# Altium project phoenix-c1.PrjPcb (part 2 of 3)

## Sheet power_input.SchDoc
size A4; SheetNumber: 3; SheetTotal: 11
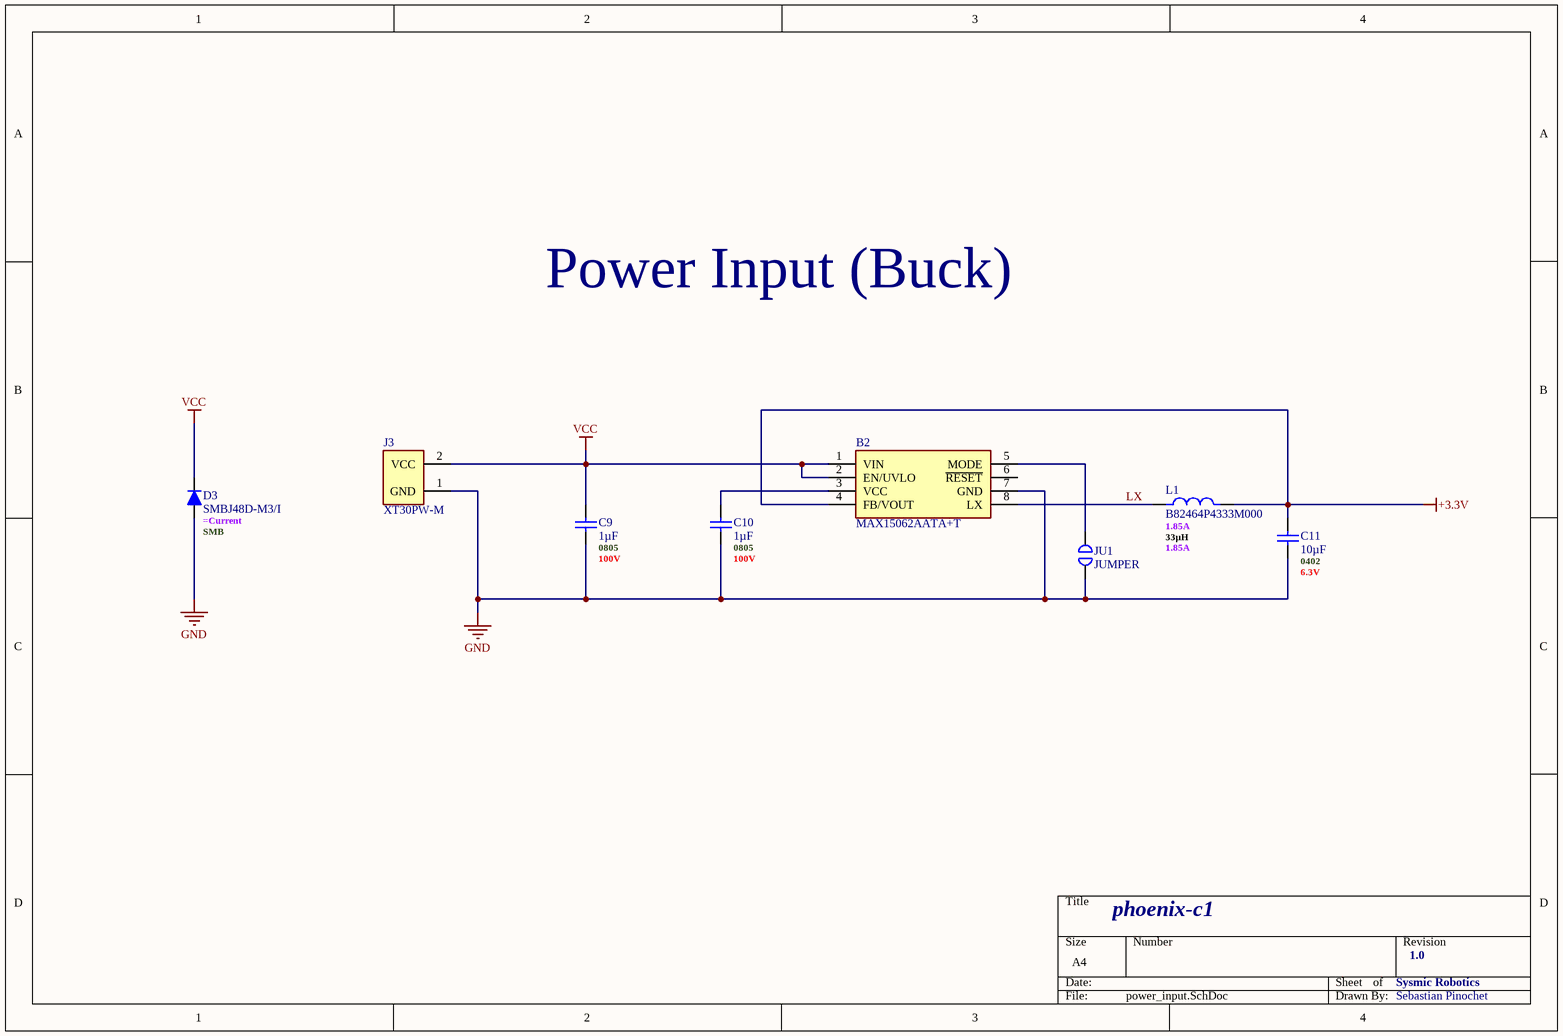
[diagram p6: power_input.SchDoc]

### Parts
B2  MAX15062AATA+T  [8-TDFN - ANALOG]
C9  1µF  .Case/Package: 0805  .Voltage Rating (DC): 100V  [C0805 - MURATA]
C10  1µF  .Case/Package: 0805  .Voltage Rating (DC): 100V  [C0805 - MURATA]
C11  10µF  .Case/Package: 0402  .Voltage Rating (DC): 6.3V  [C0402 - MURATA]
D3  SMBJ48D-M3/I  .Case/Package: SMB  [DDO-214AA (SMBJ) - VISHAY]
J3  XT30PW-M  [CONN - XT30PW-M]
JU1  JUMPER  [JUMPER]
L1  B82464P4333M000  .RMS Current (Irms): 1.85A  .Value: 33µH  [SRN4018-330M]

### Nets
+3.3V: B2.4(FB/VOUT) C11.2 L1.2
GND: B2.7(GND) C9.1 C10.1 C11.1 D3.2 J3.1(GND) JU1.1
VCC: B2.1(VIN) B2.2(EN/UVLO) C9.2 D3.1 J3.2(VCC)
LX: B2.8(LX) L1.1
NetB2_3: B2.3(VCC) C10.2
NetB2_5: B2.5(MODE) JU1.2

Not connected (* = marked no-connect by the designer): B2 6(~{RESET})

### Notes on the sheet
- Power Input (Buck)
- phoenix-c1
- Sysmic Robotics
- 1.0
- Sebastian Pinochet

### Library data of the parts
B2 = MAX15062AATA+T: Step-Down 60V, 300mA, Ultra-Small, High-Efficiency, Synchronous  DC-DC Converters; Manufacturer_Name: Analog Devices; Geometry.Height: 0.8mm; Mouser Part Number: 700-MAX15062AATA+T; Mouser Price/Stock: https://www.mouser.co.uk/ProductDetail/Analog-Devices-Maxim-Integrated/MAX15062AATA%2bT?qs=ffX8NcjNb2RbIuhbYBH8PA%3D%3D; Manufacturer_Part_Number: MAX15062AATA+T; Datasheet Link: https://www.analog.com/MAX15062/datasheet; Supplier 1: Mouser; Supplier Part Number 1: 700-MAX15062AATA+T
C9 C10 = GCM21BC72A105KE36L: Ceramic Capacitor, Ceramic, 100V, 10% +Tol, 10% -Tol, X7S, 22% TC, 1uF, Surface Mount, 0805; Manufacturer: Murata; Manufacturer Lifecycle Status: IN PRODUCTION; Supplier: Mouser; Supplier Part Number: 81-GCM21BC72A105KE6L; Manufacturer Part Number: GCM21BC72A105KE36L; RoHS: Compliant; Category: Ceramic Capacitors; Stock: 5295; Pricing: 1=0,42, 10=0,188, 50=0,188, 100=0,164, 1000=0,123, 10000=0,085 (USD); Value: 1µF; Case/Package: 0805; Dielectric Material: Ceramic; Height: 1.25mm; Length: 2mm; Lifecycle Status: Production; Material: Ceramic; Max Operating Temperature: 125°C; Min Operating Temperature: -55°C; Mounting Technology: Surface Mount; Number of Terminals: 2; REACH SVHC: Yes; Schedule B: 8532240020, 8532240020|8532240020, 8532240020|8532240020|8532240020, 8532240020|8532240020|8532240020|8532240020; Thickness: 1.25mm; Voltage Rating: 100V; Voltage Rating (DC): 100V; Width: 1.25mm; ComponentLink1URL: https://datasheet.octopart.com:443/GCM21BC72A105KE36L-Murata-datasheet-141268580.pdf?src-supplier=Ciiva; ComponentLink1Description: https://datasheet.octopart.com:443/GCM21BC72A105KE36L-Murata-datasheet-141268580.pdf?src-supplier=Ciiva; ComponentLink2URL: https://datasheet.octopart.com:443/GCM21BC72A105KE36L-Murata-datasheet-140660122.pdf?src-supplier=Ciiva; ComponentLink2Description: https://datasheet.octopart.com:443/GCM21BC72A105KE36L-Murata-datasheet-140660122.pdf?src-supplier=Ciiva; ComponentLink3URL: https://datasheet.octopart.com:443/GCM21BC72A105KE36L-Murata-datasheet-138719526.pdf?src-supplier=Ciiva; ComponentLink3Description: https://datasheet.octopart.com:443/GCM21BC72A105KE36L-Murata-datasheet-138719526.pdf?src-supplier=Ciiva; ComponentLink4URL: https://datasheet.octopart.com:443/GCM21BC72A105KE36L-Murata-datasheet-12511495.pdf?src-supplier=TME; ComponentLink4Description: https://datasheet.octopart.com:443/GCM21BC72A105KE36L-Murata-datasheet-12511495.pdf?src-supplier=TME; ComponentLink5URL: http://sigma.octopart.com:80/reach_statement/Murata-company-16.pdf?src-supplier=Compliance+Statements; ComponentLink5Description: http://sigma.octopart.com:80/reach_statement/Murata-company-16.pdf?src-supplier=Compliance+Statements; Supplier 1: Mouser; Supplier Part Number 1: 81-GCM21BC72A105KE6L
C11 = GRM155R60J106ME05D: Ceramic Capacitor, Ceramic, 6.3V, 20% +Tol, 20% -Tol, X5R, 15% TC, 10uF, Surface Mount, 0402; Manufacturer: Murata; Manufacturer Lifecycle Status: IN PRODUCTION; Supplier: Mouser; Supplier Part Number: 81-GRM155R60J106M05D; Manufacturer Part Number: GRM155R60J106ME05D; RoHS: Compliant; Category: Ceramic Capacitors; Stock: 374888; Pricing: 1=0,1, 10=0,021, 50=0,021, 100=0,019, 1000=0,018, 10000=0,014 (USD); Value: 10µF; Case/Package: 0402; Dielectric: X5R; Dielectric Material: Ceramic; Height: 500µm; Length: 1mm; Lifecycle Status: Production; Material: Ceramic; Max Operating Temperature: 85°C; Min Operating Temperature: -55°C; Mounting Technology: Surface Mount; Number of Terminals: 2; REACH SVHC: Yes; Schedule B: 8532240020|8532240020|8532240020|8532240020|8532240020|8532240020|8532240020|8532240020|8532240020|8532240020|8532240020|8532240020|8532240020|8532240020|8532240020|8532240020|8532240020|8532240020|8532240020|8532240020|8532240020|8532240020|8532240020|85; Thickness: 500µm; Tolerance: 20%; Voltage Rating: 6.3V; Voltage Rating (DC): 6.3V; Width: 500µm; ComponentLink1URL: https://datasheet.octopart.com:443/GRM155R60J106ME05D-Murata-datasheet-155239051.pdf?src-supplier=Newark; ComponentLink1Description: https://datasheet.octopart.com:443/GRM155R60J106ME05D-Murata-datasheet-155239051.pdf?src-supplier=Newark; ComponentLink2URL: https://datasheet.octopart.com:443/GRM155R60J106ME05D-Murata-datasheet-165579666.pdf?src-supplier=TME; ComponentLink2Description: https://datasheet.octopart.com:443/GRM155R60J106ME05D-Murata-datasheet-165579666.pdf?src-supplier=TME; ComponentLink3URL: https://datasheet.octopart.com:443/GRM155R60J106ME05D-Murata-datasheet-141266224.pdf?src-supplier=Ciiva; ComponentLink3Description: https://datasheet.octopart.com:443/GRM155R60J106ME05D-Murata-datasheet-141266224.pdf?src-supplier=Ciiva; ComponentLink4URL: https://datasheet.octopart.com:443/GRM155R60J106ME05D-Murata-datasheet-140689296.pdf?src-supplier=Ciiva; ComponentLink4Description: https://datasheet.octopart.com:443/GRM155R60J106ME05D-Murata-datasheet-140689296.pdf?src-supplier=Ciiva; ComponentLink5URL: https://datasheet.octopart.com:443/GRM155R60J106ME05D-Murata-datasheet-138740637.pdf?src-supplier=Ciiva; ComponentLink5Description: https://datasheet.octopart.com:443/GRM155R60J106ME05D-Murata-datasheet-138740637.pdf?src-supplier=Ciiva; ComponentLink6URL: https://datasheet.octopart.com/GRM155R60J106ME05D-Murata-datasheet-12515295.pdf; ComponentLink6Description: https://datasheet.octopart.com/GRM155R60J106ME05D-Murata-datasheet-12515295.pdf; ComponentLink7URL: https://datasheet.octopart.com/GRM155R60J106ME05D-Murata-datasheet-12510076.pdf; ComponentLink7Description: https://datasheet.octopart.com/GRM155R60J106ME05D-Murata-datasheet-12510076.pdf; ComponentLink8URL: https://datasheet.octopart.com/GRM155R60J106ME05D-Murata-datasheet-11978611.pdf; ComponentLink8Description: https://datasheet.octopart.com/GRM155R60J106ME05D-Murata-datasheet-11978611.pdf; ComponentLink9URL: https://datasheet.octopart.com/GRM155R60J106ME05D-Murata-datasheet-10025737.pdf; ComponentLink9Description: https://datasheet.octopart.com/GRM155R60J106ME05D-Murata-datasheet-10025737.pdf; ComponentLink10URL: https://datasheet.octopart.com/GRM155R60J106ME05D-Murata-datasheet-8819587.pdf; ComponentLink10Description: https://datasheet.octopart.com/GRM155R60J106ME05D-Murata-datasheet-8819587.pdf; ComponentLink11URL: http://sigma.octopart.com:80/reach_statement/Murata-company-16.pdf?src-supplier=Compliance+Statements; ComponentLink11Description: http://sigma.octopart.com:80/reach_statement/Murata-company-16.pdf?src-supplier=Compliance+Statements; Supplier 1: Mouser; Supplier Part Number 1: 81-GRM155R60J106M05D
D3 = SMBJ48D-M3/I: Trans Voltage Suppressor Diode, 600W, 48V V(RWM), Unidirectional, 1 Element, Silicon, DO-214AA; Manufacturer: Vishay; Breakdown Voltage: 56.1V; Clamping Voltage: 76.3V; Max Breakdown Voltage: 58.1V; Max Power Dissipation: 1W; Min Breakdown Voltage: 54.1V; Number of Elements: 1; Peak Pulse Current: 7.9A; Power Line Protection: No; Supplier: Mouser; Supplier Part Number: 78-SMBJ48D-M3I; Manufacturer Part Number: SMBJ48D-M3/I; RoHS: Compliant; Category: TVS Diodes; Stock: 7114; Pricing: 1=0,34, 10=0,24, 50=0,24, 100=0,091, 1000=0,091, 10000=0,073 (USD); Case/Package: SMB; China RoHS: Non-Compliant; Composition: Zener; Lifecycle Status: Production; Max Operating Temperature: 150°C; Min Operating Temperature: -55°C; Mounting Technology: Surface Mount; Number of Terminals: 2; Number of Unidirectional Channels: 1; Packaging: Tape & Reel (TR); Peak Pulse Power: 600W; Polarity: Unidirectional; REACH SVHC: No; Reverse Standoff Voltage: 48V; ComponentLink1URL: https://datasheet.octopart.com:443/SMBJ48D-M3-I-Vishay-datasheet-168801400.pdf?src-supplier=IHS; ComponentLink1Description: https://datasheet.octopart.com:443/SMBJ48D-M3-I-Vishay-datasheet-168801400.pdf?src-supplier=IHS; ComponentLink2URL: https://datasheet.octopart.com:443/SMBJ48D-M3-I-Vishay-datasheet-141892618.pdf?src-supplier=Future+Electronics; ComponentLink2Description: https://datasheet.octopart.com:443/SMBJ48D-M3-I-Vishay-datasheet-141892618.pdf?src-supplier=Future+Electronics; ComponentLink3URL: http://sigma.octopart.com:80/rohs_statement/Vishay-company-15.pdf?src-supplier=Compliance+Statements; ComponentLink3Description: http://sigma.octopart.com:80/rohs_statement/Vishay-company-15.pdf?src-supplier=Compliance+Statements; Supplier 1: Mouser; Supplier Part Number 1: 78-SMBJ48D-M3I; .Current: =Current
J3 = XT30PW-M: 30A Low Temperature Rise Fire Retardant Plug; Manufacturer_Name: Amass; Geometry.Height: 5mm; Mouser Part Number: *; Mouser Price/Stock: *; Arrow Part Number: *; Arrow Price/Stock: *; Datasheet Link: https://www.tme.eu/sl/Document/ce4077e36b79046da520ca73227e15de/XT30PW%20SPEC.pdf; Manufacturer_Part_Number: XT30PW-M
L1 = LPS4018-333MRC: General Purpose Inductor, 33uH, 20%, 1 Element, Ferrite-Core, SMD, 1515; Manufacturer: EPCOS; Manufacturer Lifecycle Status: PRODUCTION; DC Resistance (DCR): 75mΩ; Value: 33µH; Number of Circuits: 1; Saturation Current: 2.1A; Shielding: Yes; Test Frequency: 100kHz; Current Rating: 260mA; Q Factor: 30; Self Resonant Frequency: 60MHz; Max Saturation Current: 450mA; Max Temperature Rise Current: 600mA; Temperature Rise Current: 650mA; Supplier: Mouser; Supplier Part Number: 871-B82464P4333M; Manufacturer Part Number: B82464P4333M000; RoHS: Compliant; Category: Fixed Inductors; Stock: 942; Pricing: 1=1,59, 10=1,31, 50=1,14, 100=1,08, 1000=0,885, 10000=0,775 (USD); Case/Package: SMD/SMT; Contact Plating: Tin; Core Material: Ferrite; DC Current: 1.85A; Depth: 10.4mm; Height: 4.8mm; Inductance Tolerance: 20%; Length: 10.4mm; Lifecycle Status: Production; Max Current Rating: 1.85A; Max DC Current: 1.85A; Max Length: 10.4mm; Max Operating Temperature: 150°C; Max Width: 10.4mm; Military Standard: Not; Min Operating Temperature: -55°C; Mounting Technology: Surface Mount; Number of Terminals: 2; REACH SVHC: Yes; RMS Current (Irms): 1.85A; Tolerance: 20%; Width: 10.4mm; ComponentLink1URL: https://datasheet.octopart.com:443/B82464P4333M000-EPCOS-datasheet-155394167.pdf?src-supplier=IHS; ComponentLink1Description: https://datasheet.octopart.com:443/B82464P4333M000-EPCOS-datasheet-155394167.pdf?src-supplier=IHS; ComponentLink2URL: https://datasheet.octopart.com:443/B82464P4333M000-EPCOS-datasheet-13705212.pdf?src-supplier=EPCOS; ComponentLink2Description: https://datasheet.octopart.com:443/B82464P4333M000-EPCOS-datasheet-13705212.pdf?src-supplier=EPCOS; ComponentLink3URL: https://datasheet.octopart.com:443/B82464P4333M000-EPCOS-datasheet-66576979.pdf?src-supplier=Newark; ComponentLink3Description: https://datasheet.octopart.com:443/B82464P4333M000-EPCOS-datasheet-66576979.pdf?src-supplier=Newark; ComponentLink4URL: https://datasheet.octopart.com:443/B82464P4333M000-EPCOS-datasheet-34142370.pdf?src-supplier=Newark; ComponentLink4Description: https://datasheet.octopart.com:443/B82464P4333M000-EPCOS-datasheet-34142370.pdf?src-supplier=Newark; ComponentLink5URL: https://datasheet.octopart.com:443/B82464P4333M000-EPCOS-datasheet-11522271.pdf?src-supplier=element14+APAC; ComponentLink5Description: https://datasheet.octopart.com:443/B82464P4333M000-EPCOS-datasheet-11522271.pdf?src-supplier=element14+APAC; Case Code (Imperial): 1210; Case Code (Metric): 3225; Composition: Wirewound; Height - Seated (Max): 2.3876mm; Lead Free: Lead Free; Min Length: 3mm; Min Width: 2.3mm; Schedule B: 8504500000, 8504500000|8504500000|8504500000|8504500000|8504500000; Termination: SMD/SMT; Weight: 50.008559mg; ComponentLink6URL: https://datasheet.octopart.com:443/NLV32T-3R3J-EF-TDK-datasheet-181268619.pdf?src-supplier=IHS; ComponentLink6Description: https://datasheet.octopart.com:443/NLV32T-3R3J-EF-TDK-datasheet-181268619.pdf?src-supplier=IHS; ComponentLink7URL: https://datasheet.octopart.com:443/NLV32T-3R3J-EF-TDK-datasheet-155380433.pdf?src-supplier=TDK; ComponentLink7Description: https://datasheet.octopart.com:443/NLV32T-3R3J-EF-TDK-datasheet-155380433.pdf?src-supplier=TDK; ComponentLink8URL: https://datasheet.octopart.com:443/NLV32T-3R3J-EF-TDK-datasheet-97126320.pdf?src-supplier=Newark; ComponentLink8Description: https://datasheet.octopart.com:443/NLV32T-3R3J-EF-TDK-datasheet-97126320.pdf?src-supplier=Newark; ComponentLink9URL: https://datasheet.octopart.com:443/NLV32T-3R3J-EF-TDK-datasheet-81471259.pdf?src-supplier=Newark; ComponentLink9Description: https://datasheet.octopart.com:443/NLV32T-3R3J-EF-TDK-datasheet-81471259.pdf?src-supplier=Newark; ComponentLink10URL: https://datasheet.octopart.com:443/NLV32T-3R3J-EF-TDK-datasheet-136874827.pdf?src-supplier=TME; ComponentLink10Description: https://datasheet.octopart.com:443/NLV32T-3R3J-EF-TDK-datasheet-136874827.pdf?src-supplier=TME; ComponentLink11URL: https://datasheet.octopart.com:443/NLV32T-3R3J-EF-TDK-datasheet-61115007.pdf?src-supplier=Future+Electronics; ComponentLink11Description: https://datasheet.octopart.com:443/NLV32T-3R3J-EF-TDK-datasheet-61115007.pdf?src-supplier=Future+Electronics; Packaging: Tape & Reel (TR); ComponentLink12URL: https://datasheet.octopart.com:443/MBKK1608T3R3M-Taiyo-Yuden-datasheet-181265470.pdf?src-supplier=IHS; ComponentLink12Description: https://datasheet.octopart.com:443/MBKK1608T3R3M-Taiyo-Yuden-datasheet-181265470.pdf?src-supplier=IHS; ComponentLink13URL: https://datasheet.octopart.com:443/MBKK1608T3R3M-Taiyo-Yuden-datasheet-154809596.pdf?src-supplier=Master+Electronics; ComponentLink13Description: https://datasheet.octopart.com:443/MBKK1608T3R3M-Taiyo-Yuden-datasheet-154809596.pdf?src-supplier=Master+Electronics; ComponentLink14URL: https://datasheet.octopart.com:443/MBKK1608T3R3M-Taiyo-Yuden-datasheet-168245478.pdf?src-supplier=Future+Electronics; ComponentLink14Description: https://datasheet.octopart.com:443/MBKK1608T3R3M-Taiyo-Yuden-datasheet-168245478.pdf?src-supplier=Future+Electronics; ComponentLink15URL: https://datasheet.octopart.com:443/MBKK1608T3R3M-Taiyo-Yuden-datasheet-140707427.pdf?src-supplier=Taiyo+Yuden+SCT; ComponentLink15Description: https://datasheet.octopart.com:443/MBKK1608T3R3M-Taiyo-Yuden-datasheet-140707427.pdf?src-supplier=Taiyo+Yuden+SCT; ComponentLink16URL: https://datasheet.octopart.com:443/LPS4018-333MRC-Coilcraft-datasheet-178522552.pdf?src-supplier=IHS; ComponentLink16Description: https://datasheet.octopart.com:443/LPS4018-333MRC-Coilcraft-datasheet-178522552.pdf?src-supplier=IHS; ComponentLink17URL: https://datasheet.octopart.com:443/LPS4018-333MRC-Coilcraft-datasheet-10791166.pdf?src-supplier=Coilcraft+Direct; ComponentLink17Description: https://datasheet.octopart.com:443/LPS4018-333MRC-Coilcraft-datasheet-10791166.pdf?src-supplier=Coilcraft+Direct; Supplier 1: Mouser; Supplier Part Number 1: 994-LPS4018-333MRC; .Max DC Current: 1.85A

## Sheet stm32g4.SchDoc
size A4; SheetNumber: 2; SheetTotal: 11
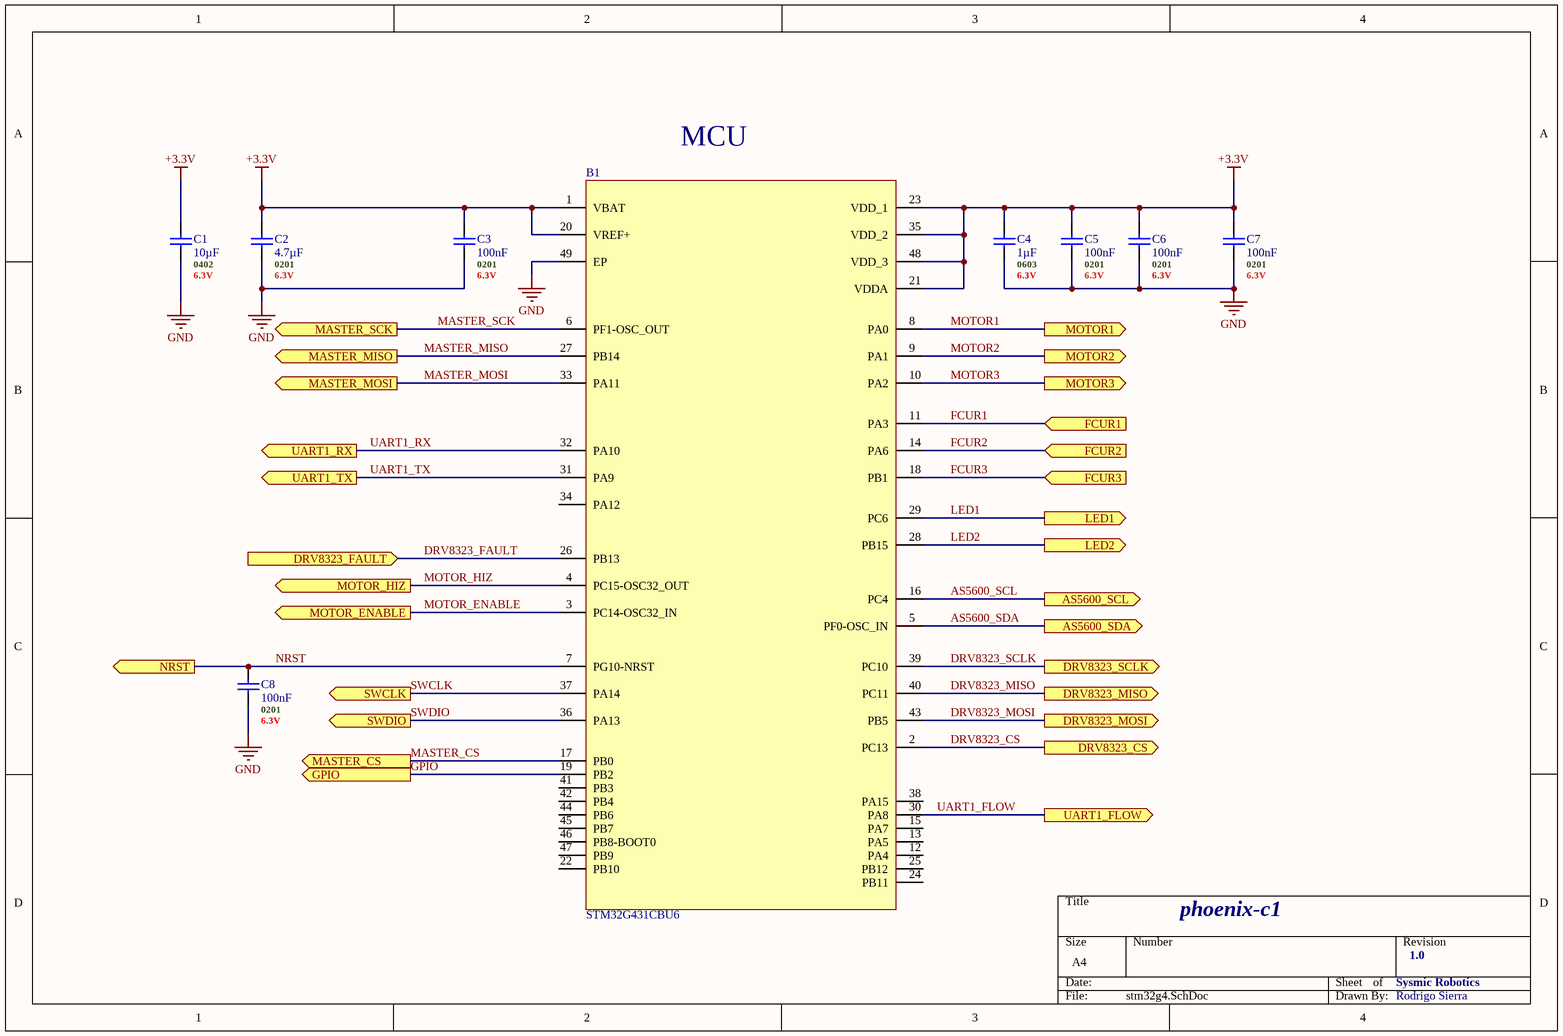
[diagram p7: stm32g4.SchDoc]

### Parts
B1  STM32G431CBU6  [48-UFQFN - STMicroelectronics]
C1  10µF  .Case/Package: 0402  .Voltage Rating (DC): 6.3V  [C0402 - MURATA]
C2  4.7µF  .Case/Package: 0201  .Voltage Rating (DC): 6.3V  [C0201 - MURATA]
C3  100nF  .Case/Package: 0201  .Voltage Rating (DC): 6.3V  [C0201 - MURATA]
C4  1µF  .Case/Package: 0603  .Voltage Rating (DC): 6.3V  [C0603 - MURATA]
C5  100nF  .Case/Package: 0201  .Voltage Rating (DC): 6.3V  [C0201 - MURATA]
C6  100nF  .Case/Package: 0201  .Voltage Rating (DC): 6.3V  [C0201 - MURATA]
C7  100nF  .Case/Package: 0201  .Voltage Rating (DC): 6.3V  [C0201 - MURATA]
C8  100nF  .Case/Package: 0201  .Voltage Rating (DC): 6.3V  [C0201 - MURATA]

### Ports
AS5600_SCL (out, see phoenix-c1-sch[2C], encoder[3B]), AS5600_SDA (out, see phoenix-c1-sch[2C], encoder[3B]), DRV8323_CS (out, see phoenix-c1-sch[3C], gate_driver[1C]), DRV8323_FAULT (in, see phoenix-c1-sch[3C], gate_driver[1C]), DRV8323_MISO (out, see phoenix-c1-sch[3B], gate_driver[1C]), DRV8323_MOSI (out, see phoenix-c1-sch[3C], gate_driver[1C]), DRV8323_SCLK (out, see phoenix-c1-sch[3C], gate_driver[1C]), FCUR1 (in, see phoenix-c1-sch[3C], gate_driver[4B]), FCUR2 (in, see phoenix-c1-sch[3C], gate_driver[4B]), FCUR3 (in, see phoenix-c1-sch[3C], gate_driver[4C]), GPIO (out, see phoenix-c1-sch[2B], external_ports[3C]), LED1 (out, see phoenix-c1-sch[2C], leds[2C]), LED2 (out, see phoenix-c1-sch[2C], leds[3C]), MASTER_CS (out, see phoenix-c1-sch[2B], external_ports[3C]), MASTER_MISO (out, see phoenix-c1-sch[2B], external_ports[3B]), MASTER_MOSI (out, see phoenix-c1-sch[2B], external_ports[3B]), MASTER_SCK (out, see phoenix-c1-sch[2B], external_ports[3B]), MOTOR1 (out, see phoenix-c1-sch[3B], gate_driver[1B]), MOTOR2 (out, see phoenix-c1-sch[3B], gate_driver[1B]), MOTOR3 (out, see phoenix-c1-sch[3B], gate_driver[1C]), MOTOR_ENABLE (out, see phoenix-c1-sch[3B], gate_driver[1B]), MOTOR_HIZ (out, see phoenix-c1-sch[3B], gate_driver[1B]), NRST (out, see phoenix-c1-sch[2B], external_ports[2C]), SWCLK (out, see phoenix-c1-sch[2B], external_ports[2B]), SWDIO (out, see phoenix-c1-sch[2B], external_ports[2C]), UART1_FLOW (out, see phoenix-c1-sch[2B], external_ports[4C]), UART1_RX (out, see phoenix-c1-sch[2B], external_ports[4B]), UART1_TX (out, see phoenix-c1-sch[2B], external_ports[4B])

### Nets
+3.3V: B1.1(VBAT) B1.20(VREF+) B1.21(VDDA) B1.23(VDD_1) B1.35(VDD_2) B1.48(VDD_3) C1.2 C2.2 C3.2 C4.2 C5.2 C6.2 C7.2
GND: B1.49(EP) C1.1 C2.1 C3.1 C4.1 C5.1 C6.1 C7.1 C8.1
AS5600_SCL: B1.16(PC4) ; port AS5600_SCL
AS5600_SDA: B1.5(PF0-OSC_IN) ; port AS5600_SDA
DRV8323_CS: B1.2(PC13) ; port DRV8323_CS
DRV8323_FAULT: B1.26(PB13) ; port DRV8323_FAULT
DRV8323_MISO: B1.40(PC11) ; port DRV8323_MISO
DRV8323_MOSI: B1.43(PB5) ; port DRV8323_MOSI
DRV8323_SCLK: B1.39(PC10) ; port DRV8323_SCLK
FCUR1: B1.11(PA3) ; port FCUR1
FCUR2: B1.14(PA6) ; port FCUR2
FCUR3: B1.18(PB1) ; port FCUR3
GPIO: B1.19(PB2) ; port GPIO
LED1: B1.29(PC6) ; port LED1
LED2: B1.28(PB15) ; port LED2
MASTER_CS: B1.17(PB0) ; port MASTER_CS
MASTER_MISO: B1.27(PB14) ; port MASTER_MISO
MASTER_MOSI: B1.33(PA11) ; port MASTER_MOSI
MASTER_SCK: B1.6(PF1-OSC_OUT) ; port MASTER_SCK
MOTOR1: B1.8(PA0) ; port MOTOR1
MOTOR2: B1.9(PA1) ; port MOTOR2
MOTOR3: B1.10(PA2) ; port MOTOR3
MOTOR_ENABLE: B1.3(PC14-OSC32_IN) ; port MOTOR_ENABLE
MOTOR_HIZ: B1.4(PC15-OSC32_OUT) ; port MOTOR_HIZ
NRST: B1.7(PG10-NRST) C8.2 ; port NRST
SWCLK: B1.37(PA14) ; port SWCLK
SWDIO: B1.36(PA13) ; port SWDIO
UART1_FLOW: B1.30(PA8) ; port UART1_FLOW
UART1_RX: B1.32(PA10) ; port UART1_RX
UART1_TX: B1.31(PA9) ; port UART1_TX

Not connected (* = marked no-connect by the designer): B1 12(PA4) 13(PA5) 15(PA7) 22(PB10) 24(PB11) 25(PB12) 34(PA12) 38(PA15) 41(PB3) 42(PB4) 44(PB6) 45(PB7) 46(PB8-BOOT0) 47(PB9)

### Notes on the sheet
- MCU
- phoenix-c1
- Sysmic Robotics
- 1.0
- Rodrigo Sierra

### Library data of the parts
B1 = STM32G431CBU6: STMICROELECTRONICS - STM32G431CBU6 - MCU, 32BIT, 170MHZ, UFQFPN-48; Geometry.Height: 0.65mm; Mouser Part Number: 511-STM32G431CBU6; Mouser Price/Stock: https://www.mouser.co.uk/ProductDetail/STMicroelectronics/STM32G431CBU6?qs=T3oQrply3y%252B0hTuSHQ7oqA%3D%3D; Manufacturer_Name: STMicroelectronics; Manufacturer_Part_Number: STM32G431CBU6; Datasheet Link: https://www.st.com/resource/en/datasheet/stm32g431cb.pdf; Supplier 1: Mouser; Supplier Part Number 1: 511-STM32G431CBU6
C1 = GRM155R60J106ME05D: as C11 on sheet power_input; Supplier: Mouser; Supplier Part Number: 81-GRM155R60J106M05D; Manufacturer Part Number: GRM155R60J106ME05D; RoHS: Compliant; Category: Ceramic Capacitors; Stock: 374888; Pricing: 1=0,1, 10=0,021, 50=0,021, 100=0,019, 1000=0,018, 10000=0,014 (USD); Value: 10µF; Case/Package: 0402; Dielectric: X5R; Dielectric Material: Ceramic; Height: 500µm; Length: 1mm; Lifecycle Status: Production; Material: Ceramic; Max Operating Temperature: 85°C; Min Operating Temperature: -55°C; Mounting Technology: Surface Mount; Number of Terminals: 2; REACH SVHC: Yes; Schedule B: 8532240020|8532240020|8532240020|8532240020|8532240020|8532240020|8532240020|8532240020|8532240020|8532240020|8532240020|8532240020|8532240020|8532240020|8532240020|8532240020|8532240020|8532240020|8532240020|8532240020|8532240020|8532240020|8532240020|85; Thickness: 500µm; Tolerance: 20%; Voltage Rating: 6.3V; Voltage Rating (DC): 6.3V; Width: 500µm; ComponentLink1URL: https://datasheet.octopart.com:443/GRM155R60J106ME05D-Murata-datasheet-155239051.pdf?src-supplier=Newark; ComponentLink1Description: https://datasheet.octopart.com:443/GRM155R60J106ME05D-Murata-datasheet-155239051.pdf?src-supplier=Newark; ComponentLink2URL: https://datasheet.octopart.com:443/GRM155R60J106ME05D-Murata-datasheet-165579666.pdf?src-supplier=TME; ComponentLink2Description: https://datasheet.octopart.com:443/GRM155R60J106ME05D-Murata-datasheet-165579666.pdf?src-supplier=TME; ComponentLink3URL: https://datasheet.octopart.com:443/GRM155R60J106ME05D-Murata-datasheet-141266224.pdf?src-supplier=Ciiva; ComponentLink3Description: https://datasheet.octopart.com:443/GRM155R60J106ME05D-Murata-datasheet-141266224.pdf?src-supplier=Ciiva; ComponentLink4URL: https://datasheet.octopart.com:443/GRM155R60J106ME05D-Murata-datasheet-140689296.pdf?src-supplier=Ciiva; ComponentLink4Description: https://datasheet.octopart.com:443/GRM155R60J106ME05D-Murata-datasheet-140689296.pdf?src-supplier=Ciiva; ComponentLink5URL: https://datasheet.octopart.com:443/GRM155R60J106ME05D-Murata-datasheet-138740637.pdf?src-supplier=Ciiva; ComponentLink5Description: https://datasheet.octopart.com:443/GRM155R60J106ME05D-Murata-datasheet-138740637.pdf?src-supplier=Ciiva; ComponentLink6URL: https://datasheet.octopart.com/GRM155R60J106ME05D-Murata-datasheet-12515295.pdf; ComponentLink6Description: https://datasheet.octopart.com/GRM155R60J106ME05D-Murata-datasheet-12515295.pdf; ComponentLink7URL: https://datasheet.octopart.com/GRM155R60J106ME05D-Murata-datasheet-12510076.pdf; ComponentLink7Description: https://datasheet.octopart.com/GRM155R60J106ME05D-Murata-datasheet-12510076.pdf; ComponentLink8URL: https://datasheet.octopart.com/GRM155R60J106ME05D-Murata-datasheet-11978611.pdf; ComponentLink8Description: https://datasheet.octopart.com/GRM155R60J106ME05D-Murata-datasheet-11978611.pdf; ComponentLink9URL: https://datasheet.octopart.com/GRM155R60J106ME05D-Murata-datasheet-10025737.pdf; ComponentLink9Description: https://datasheet.octopart.com/GRM155R60J106ME05D-Murata-datasheet-10025737.pdf; ComponentLink10URL: https://datasheet.octopart.com/GRM155R60J106ME05D-Murata-datasheet-8819587.pdf; ComponentLink10Description: https://datasheet.octopart.com/GRM155R60J106ME05D-Murata-datasheet-8819587.pdf; ComponentLink11URL: http://sigma.octopart.com:80/reach_statement/Murata-company-16.pdf?src-supplier=Compliance+Statements; ComponentLink11Description: http://sigma.octopart.com:80/reach_statement/Murata-company-16.pdf?src-supplier=Compliance+Statements; Supplier 1: Mouser; Supplier Part Number 1: 81-GRM155R60J106M05D
C2 = GRM035R60J475ME15D: Ceramic Capacitor, Ceramic, 6.3V, 20% +Tol, 20% -Tol, X5R, 15% TC, 4.7uF, Surface Mount, 0201; Manufacturer: Murata; Manufacturer Lifecycle Status: IN PRODUCTION; Supplier: Mouser; Supplier Part Number: 81-GRM035R60J475ME5D; Manufacturer Part Number: GRM035R60J475ME15D; RoHS: Compliant; Category: Ceramic Capacitors; Stock: 788914; Pricing: 1=0,1, 10=0,039, 50=0,039, 100=0,039, 1000=0,039, 10000=0,033 (USD); Value: 4.7µF; Case/Package: 0201; Case Code (Imperial): 0201; Case Code (Metric): 0603; Dielectric: X5R; Dielectric Material: Ceramic; Height: 500µm; Length: 600µm; Lifecycle Status: Production; Material: Ceramic; Max Operating Temperature: 85°C; Min Operating Temperature: -55°C; Mounting Technology: Surface Mount; Number of Terminals: 2; REACH SVHC: Yes; Schedule B: 8532240020, 8532240020|8532240020, 8532240020|8532240020|8532240020, 8532240020|8532240020|8532240020|8532240020; Thickness: 500µm; Tolerance: 20%; Voltage Rating: 6.3V; Voltage Rating (DC): 6.3V; Width: 300µm; ComponentLink1URL: https://datasheet.octopart.com:443/GRM035R60J475ME15D-Murata-datasheet-149522819.pdf?src-supplier=Farnell; ComponentLink1Description: https://datasheet.octopart.com:443/GRM035R60J475ME15D-Murata-datasheet-149522819.pdf?src-supplier=Farnell; ComponentLink2URL: https://datasheet.octopart.com:443/GRM035R60J475ME15D-Murata-datasheet-165579666.pdf?src-supplier=TME; ComponentLink2Description: https://datasheet.octopart.com:443/GRM035R60J475ME15D-Murata-datasheet-165579666.pdf?src-supplier=TME; ComponentLink3URL: https://datasheet.octopart.com:443/GRM035R60J475ME15D-Murata-datasheet-140678601.pdf?src-supplier=Ciiva; ComponentLink3Description: https://datasheet.octopart.com:443/GRM035R60J475ME15D-Murata-datasheet-140678601.pdf?src-supplier=Ciiva; ComponentLink4URL: https://datasheet.octopart.com:443/GRM035R60J475ME15D-Murata-datasheet-140677062.pdf?src-supplier=Ciiva; ComponentLink4Description: https://datasheet.octopart.com:443/GRM035R60J475ME15D-Murata-datasheet-140677062.pdf?src-supplier=Ciiva; ComponentLink5URL: https://datasheet.octopart.com:443/GRM035R60J475ME15D-Murata-datasheet-138738751.pdf?src-supplier=Ciiva; ComponentLink5Description: https://datasheet.octopart.com:443/GRM035R60J475ME15D-Murata-datasheet-138738751.pdf?src-supplier=Ciiva; ComponentLink6URL: https://datasheet.octopart.com:443/GRM035R60J475ME15D-Murata-datasheet-140089765.pdf?src-supplier=Future+Electronics; ComponentLink6Description: https://datasheet.octopart.com:443/GRM035R60J475ME15D-Murata-datasheet-140089765.pdf?src-supplier=Future+Electronics; ComponentLink7URL: https://datasheet.octopart.com/GRM035R60J475ME15D-Murata-datasheet-12515295.pdf; ComponentLink7Description: https://datasheet.octopart.com/GRM035R60J475ME15D-Murata-datasheet-12515295.pdf; ComponentLink8URL: https://datasheet.octopart.com/GRM035R60J475ME15D-Murata-datasheet-12510076.pdf; ComponentLink8Description: https://datasheet.octopart.com/GRM035R60J475ME15D-Murata-datasheet-12510076.pdf; ComponentLink9URL: https://datasheet.octopart.com/GRM035R60J475ME15D-Murata-datasheet-11978611.pdf; ComponentLink9Description: https://datasheet.octopart.com/GRM035R60J475ME15D-Murata-datasheet-11978611.pdf; ComponentLink10URL: https://datasheet.octopart.com/GRM035R60J475ME15D-Murata-datasheet-10025737.pdf; ComponentLink10Description: https://datasheet.octopart.com/GRM035R60J475ME15D-Murata-datasheet-10025737.pdf; ComponentLink11URL: https://datasheet.octopart.com/GRM035R60J475ME15D-Murata-datasheet-8819587.pdf; ComponentLink11Description: https://datasheet.octopart.com/GRM035R60J475ME15D-Murata-datasheet-8819587.pdf; ComponentLink12URL: http://sigma.octopart.com:80/reach_statement/Murata-company-16.pdf?src-supplier=Compliance+Statements; ComponentLink12Description: http://sigma.octopart.com:80/reach_statement/Murata-company-16.pdf?src-supplier=Compliance+Statements; Supplier 1: Mouser; Supplier Part Number 1: 81-GRM035R60J475ME5D
C3 C5-C8 = GRT033R60J104KE01J: Ceramic Capacitor, Multilayer, Ceramic, 6.3V, 10% +Tol, 10% -Tol, X5R, 15% TC, 0.1uF, Surface Mount, 0201; Manufacturer: Murata; Manufacturer Lifecycle Status: IN PRODUCTION; Supplier: Mouser; Supplier Part Number: 81-GRT033R60J104KE1J; Manufacturer Part Number: GRT033R60J104KE01J; RoHS: Compliant; Category: Ceramic Capacitors; Stock: 150000; Pricing: 1=0,1, 10=0,017, 50=0,017, 100=0,014, 1000=0,009, 10000=0,007 (USD); Value: 100nF; Case/Package: 0201; Dielectric Material: Ceramic; Height: 300µm; Length: 600µm; Lifecycle Status: Production; Material: Ceramic; Max Operating Temperature: 85°C; Min Operating Temperature: -55°C; Mounting Technology: Surface Mount; Number of Terminals: 2; REACH SVHC: Yes; Thickness: 300µm; Tolerance: 10%; Voltage Rating: 6.3V; Voltage Rating (DC): 6.3V; Width: 300µm; ComponentLink1URL: https://datasheet.octopart.com:443/GRT033R60J104KE01J-Murata-datasheet-141283033.pdf?src-supplier=Geoflip; ComponentLink1Description: https://datasheet.octopart.com:443/GRT033R60J104KE01J-Murata-datasheet-141283033.pdf?src-supplier=Geoflip; ComponentLink2URL: https://datasheet.octopart.com:443/GRT033R60J104KE01J-Murata-datasheet-140710645.pdf?src-supplier=Ciiva; ComponentLink2Description: https://datasheet.octopart.com:443/GRT033R60J104KE01J-Murata-datasheet-140710645.pdf?src-supplier=Ciiva; ComponentLink3URL: https://datasheet.octopart.com:443/GRT033R60J104KE01J-Murata-datasheet-138748272.pdf?src-supplier=Ciiva; ComponentLink3Description: https://datasheet.octopart.com:443/GRT033R60J104KE01J-Murata-datasheet-138748272.pdf?src-supplier=Ciiva; ComponentLink4URL: http://sigma.octopart.com:80/reach_statement/Murata-company-16.pdf?src-supplier=Compliance+Statements; ComponentLink4Description: http://sigma.octopart.com:80/reach_statement/Murata-company-16.pdf?src-supplier=Compliance+Statements; Supplier 1: Mouser; Supplier Part Number 1: 81-GRT033R60J104KE1J
C4 = GRM188R60J105KA01D: Ceramic Capacitor, Ceramic, 6.3V, 10% +Tol, 10% -Tol, X5R, 15% TC, 1uF, Surface Mount, 0603; Manufacturer: Murata; Manufacturer Lifecycle Status: NRND; Insulation Resistance: 500MΩ; Supplier: Mouser; Supplier Part Number: 81-GRM39R105K6.3; Manufacturer Part Number: GRM188R60J105KA01D; RoHS: Compliant; Category: Ceramic Capacitors; Stock: 153012; Pricing: 1=0,14, 10=0,056, 50=0,056, 100=0,049, 1000=0,035, 10000=0,019 (USD); Value: 1µF; Case/Package: 0603; Case Code (Imperial): 0603; Case Code (Metric): 1608; Depth: 800µm; Dielectric: X5R; Dielectric Material: Ceramic; Height: 800µm; Lead Free: Lead Free; Length: 1.6mm; Lifecycle Status: NRND; Material: Ceramic; Max Operating Temperature: 85°C; Min Operating Temperature: -55°C; Mounting Technology: Surface Mount; Pins: 2; Number of Terminals: 2; Radiation Hardening: No; REACH SVHC: Yes; Schedule B: 8532240020, 8532240020|8532240020, 8532240020|8532240020|8532240020, 8532240020|8532240020|8532240020|8532240020; Termination: SMD/SMT; Thickness: 800µm; Tolerance: 10%; Voltage: 6.3V; Voltage Rating: 6.3V; Voltage Rating (DC): 6.3V; Width: 800µm; ComponentLink1URL: https://datasheet.octopart.com:443/GRM188R60J105KA01D-Murata-datasheet-7599024.pdf?src-supplier=Newark; ComponentLink1Description: https://datasheet.octopart.com:443/GRM188R60J105KA01D-Murata-datasheet-7599024.pdf?src-supplier=Newark; ComponentLink2URL: https://datasheet.octopart.com:443/GRM188R60J105KA01D-Murata-datasheet-101584256.pdf?src-supplier=element14+APAC; ComponentLink2Description: https://datasheet.octopart.com:443/GRM188R60J105KA01D-Murata-datasheet-101584256.pdf?src-supplier=element14+APAC; ComponentLink3URL: https://datasheet.octopart.com:443/GRM188R60J105KA01D-Murata-datasheet-49135294.pdf?src-supplier=element14+APAC; ComponentLink3Description: https://datasheet.octopart.com:443/GRM188R60J105KA01D-Murata-datasheet-49135294.pdf?src-supplier=element14+APAC; ComponentLink4URL: https://datasheet.octopart.com:443/GRM188R60J105KA01D-Murata-datasheet-165579666.pdf?src-supplier=TME; ComponentLink4Description: https://datasheet.octopart.com:443/GRM188R60J105KA01D-Murata-datasheet-165579666.pdf?src-supplier=TME; ComponentLink5URL: https://datasheet.octopart.com:443/GRM188R60J105KA01D-Murata-datasheet-59876780.pdf?src-supplier=TME; ComponentLink5Description: https://datasheet.octopart.com:443/GRM188R60J105KA01D-Murata-datasheet-59876780.pdf?src-supplier=TME; ComponentLink6URL: https://datasheet.octopart.com:443/GRM188R60J105KA01D-Murata-datasheet-140704005.pdf?src-supplier=Ciiva; ComponentLink6Description: https://datasheet.octopart.com:443/GRM188R60J105KA01D-Murata-datasheet-140704005.pdf?src-supplier=Ciiva; ComponentLink7URL: https://datasheet.octopart.com:443/GRM188R60J105KA01D-Murata-datasheet-138742778.pdf?src-supplier=Ciiva; ComponentLink7Description: https://datasheet.octopart.com:443/GRM188R60J105KA01D-Murata-datasheet-138742778.pdf?src-supplier=Ciiva; ComponentLink8URL: https://datasheet.octopart.com:443/GRM188R60J105KA01D-Murata-datasheet-102370999.pdf?src-supplier=Future+Electronics; ComponentLink8Description: https://datasheet.octopart.com:443/GRM188R60J105KA01D-Murata-datasheet-102370999.pdf?src-supplier=Future+Electronics; ComponentLink9URL: https://datasheet.octopart.com:443/GRM188R60J105KA01D-Murata-datasheet-22122223.pdf?src-supplier=Future+Electronics; ComponentLink9Description: https://datasheet.octopart.com:443/GRM188R60J105KA01D-Murata-datasheet-22122223.pdf?src-supplier=Future+Electronics; ComponentLink10URL: https://datasheet.octopart.com:443/GRM188R60J105KA01D-Murata-datasheet-14400986.pdf?src-supplier=Future+Electronics; ComponentLink10Description: https://datasheet.octopart.com:443/GRM188R60J105KA01D-Murata-datasheet-14400986.pdf?src-supplier=Future+Electronics; ComponentLink11URL: https://datasheet.octopart.com:443/GRM188R60J105KA01D-Murata-datasheet-44107491.pdf?src-supplier=Future+Electronics; ComponentLink11Description: https://datasheet.octopart.com:443/GRM188R60J105KA01D-Murata-datasheet-44107491.pdf?src-supplier=Future+Electronics; ComponentLink12URL: https://datasheet.octopart.com/GRM188R60J105KA01D-Murata-datasheet-12515295.pdf; ComponentLink12Description: https://datasheet.octopart.com/GRM188R60J105KA01D-Murata-datasheet-12515295.pdf; ComponentLink13URL: https://datasheet.octopart.com/GRM188R60J105KA01D-Murata-datasheet-12510076.pdf; ComponentLink13Description: https://datasheet.octopart.com/GRM188R60J105KA01D-Murata-datasheet-12510076.pdf; ComponentLink14URL: https://datasheet.octopart.com/GRM188R60J105KA01D-Murata-datasheet-11978611.pdf; ComponentLink14Description: https://datasheet.octopart.com/GRM188R60J105KA01D-Murata-datasheet-11978611.pdf; ComponentLink15URL: https://datasheet.octopart.com/GRM188R60J105KA01D-Murata-datasheet-10025737.pdf; ComponentLink15Description: https://datasheet.octopart.com/GRM188R60J105KA01D-Murata-datasheet-10025737.pdf; ComponentLink16URL: https://datasheet.octopart.com/GRM188R60J105KA01D-Murata-datasheet-8819587.pdf; ComponentLink16Description: https://datasheet.octopart.com/GRM188R60J105KA01D-Murata-datasheet-8819587.pdf; ComponentLink17URL: https://datasheet.octopart.com/GRM188R60J105KA01D-Murata-datasheet-14401024.pdf; ComponentLink17Description: https://datasheet.octopart.com/GRM188R60J105KA01D-Murata-datasheet-14401024.pdf; ComponentLink18URL: https://datasheet.octopart.com:443/GRM188R60J105KA01D-Murata-datasheet-102.pdf?src-supplier=DigiKey; ComponentLink18Description: https://datasheet.octopart.com:443/GRM188R60J105KA01D-Murata-datasheet-102.pdf?src-supplier=DigiKey; ComponentLink19URL: https://datasheet.octopart.com:443/GRM188R60J105KA01D-Murata-datasheet-112596.pdf?src-supplier=Sierra+IC; ComponentLink19Description: https://datasheet.octopart.com:443/GRM188R60J105KA01D-Murata-datasheet-112596.pdf?src-supplier=Sierra+IC; ComponentLink20URL: https://datasheet.octopart.com:443/GRM188R60J105KA01D-Murata-datasheet-516848.pdf?src-supplier=Farnell; ComponentLink20Description: https://datasheet.octopart.com:443/GRM188R60J105KA01D-Murata-datasheet-516848.pdf?src-supplier=Farnell; ComponentLink21URL: http://sigma.octopart.com:80/reach_statement/Murata-company-16.pdf?src-supplier=Compliance+Statements; ComponentLink21Description: http://sigma.octopart.com:80/reach_statement/Murata-company-16.pdf?src-supplier=Compliance+Statements; Supplier 1: Mouser; Supplier Part Number 1: 81-GRM39R105K6.3

## Sheet external_ports.SchDoc
size A4; SheetNumber: 10; SheetTotal: 11
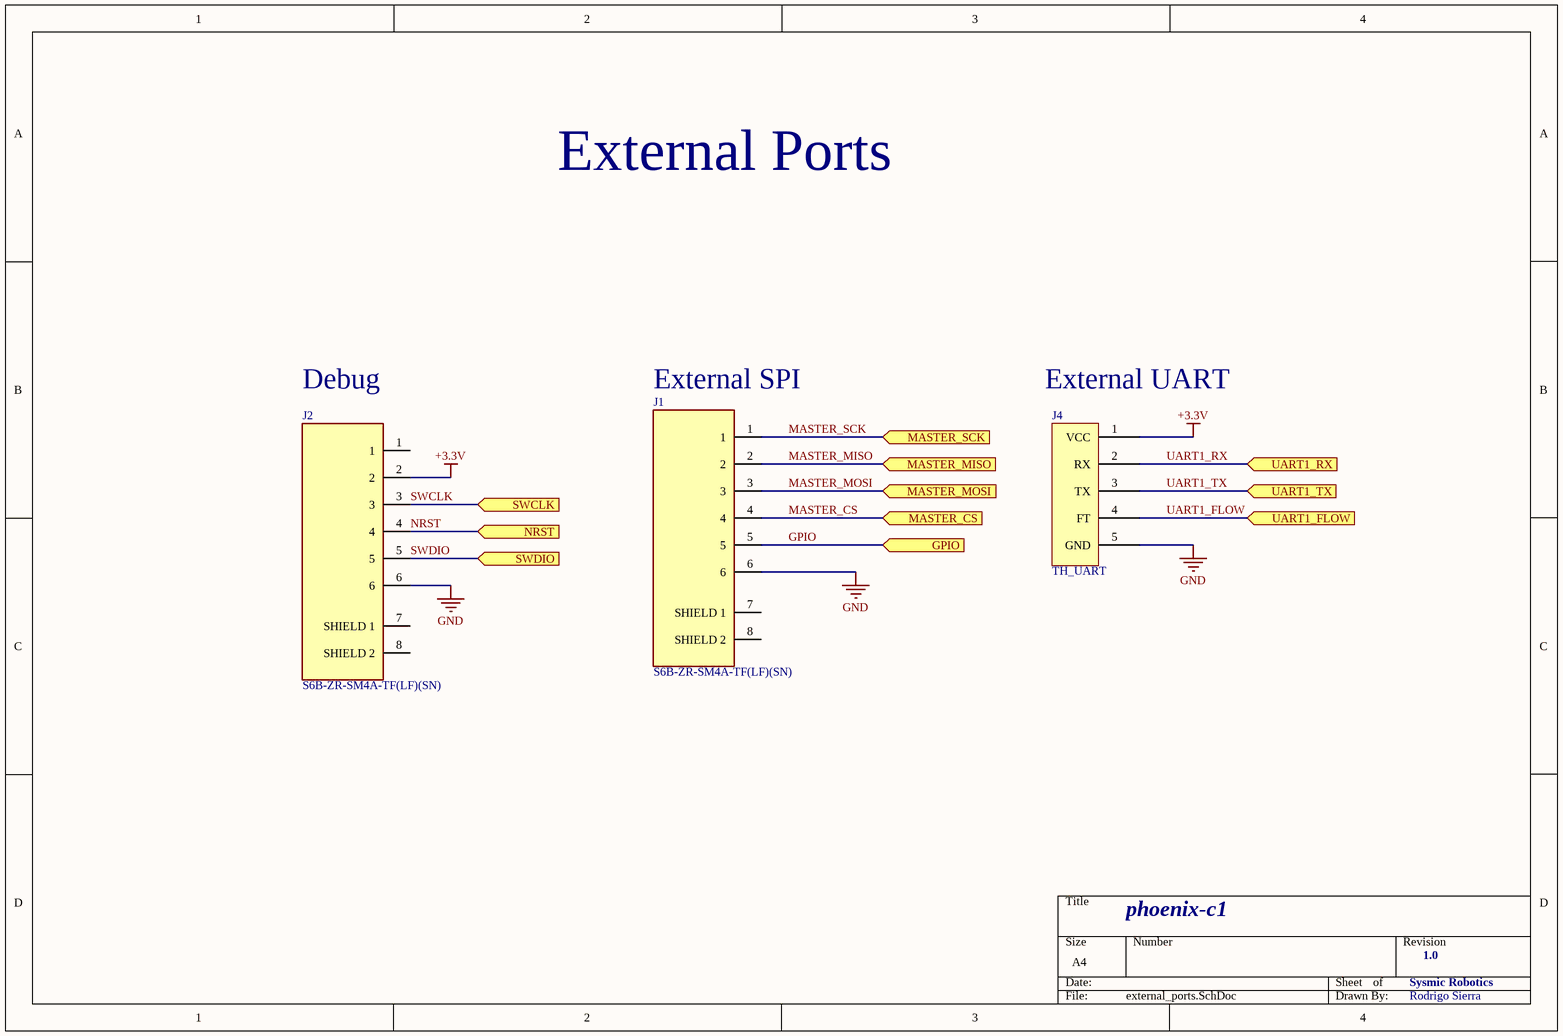
[diagram p8: external_ports.SchDoc]

### Parts
J1  S6B-ZR-SM4A-TF(LF)(SN)  [FP-S6B-ZR-SM4A-TF_LF_SN-MFG]
J2  S6B-ZR-SM4A-TF(LF)(SN)  [FP-S6B-ZR-SM4A-TF_LF_SN-MFG]
J4  TH_UART  [CONN - TH_UART]

### Ports
GPIO (in, see phoenix-c1-sch[2B], stm32g4[1D]), MASTER_CS (in, see phoenix-c1-sch[2B], stm32g4[1C]), MASTER_MISO (in, see phoenix-c1-sch[2B], stm32g4[1B]), MASTER_MOSI (in, see phoenix-c1-sch[2B], stm32g4[1B]), MASTER_SCK (in, see phoenix-c1-sch[2B], stm32g4[1B]), NRST (in, see phoenix-c1-sch[2B], stm32g4[1C]), SWCLK (in, see phoenix-c1-sch[2B], stm32g4[1C]), SWDIO (in, see phoenix-c1-sch[2B], stm32g4[1C]), UART1_FLOW (in, see phoenix-c1-sch[2B], stm32g4[1B]), UART1_RX (in, see phoenix-c1-sch[2B], stm32g4[1B]), UART1_TX (in, see phoenix-c1-sch[2B], stm32g4[1B])

### Nets
+3.3V: J2.2 J4.1(VCC)
GND: J1.6 J2.6 J4.5(GND)
GPIO: J1.5 ; port GPIO
MASTER_CS: J1.4 ; port MASTER_CS
MASTER_MISO: J1.2 ; port MASTER_MISO
MASTER_MOSI: J1.3 ; port MASTER_MOSI
MASTER_SCK: J1.1 ; port MASTER_SCK
NRST: J2.4 ; port NRST
SWCLK: J2.3 ; port SWCLK
SWDIO: J2.5 ; port SWDIO
UART1_FLOW: J4.4(FT) ; port UART1_FLOW
UART1_RX: J4.2(RX) ; port UART1_RX
UART1_TX: J4.3(TX) ; port UART1_TX

Not connected (* = marked no-connect by the designer): J1 7(SHIELD_1) 8(SHIELD_2); J2 1 7(SHIELD_1) 8(SHIELD_2)

### Notes on the sheet
- External Ports
- Debug
- (near J1) External SPI
- (near J4) External UART
- phoenix-c1
- Sysmic Robotics
- 1.0
- Rodrigo Sierra

### Library data of the parts
J1 J2 = CMP-17439-000151-1: CONN HEADER SMD R/A 6POS 1.5MM; Max Voltage Rating (DC): 50V; Number of Contacts: 6; Current Rating: 1A; Gender: Male; Contact Resistance: 30mR; Mount: Surface Mount; Lead Free: Lead Free; Height: 7.2mm; Contact Finish - Mating: TIN; Contact Type: Male Pin; Contact Shape: Circular; Insulation Material: Nylon; Contact Material: Brass; Pitch: 1.5mm; Flammability Rating: UL94 V-0; Termination: Solder; Depth: 6.5mm; Housing Color: Beige; Min Operating Temperature: -25°C; Connector Type: Header; Length: 12mm; Housing Material: Polyamide; Fastening Type: Detent; Insulation Color: Natural; Max Voltage Rating (AC): 50V; Orientation: Right Angle; Number of Positions: 6; Max Operating Temperature: 85°C; Voltage Rating: 50V; Max Current Rating: 1A; Series: ZH; Color: Natural; Width: 3.5mm; Number of Rows: 1; Packaging: Tape and Reel; Contact Plating: Copper; Supplier 1: Mouser; Supplier Part Number 1: 306-S6BZRSM4ATFLFSN

## Sheet leds.SchDoc
size A4; SheetNumber: 11; SheetTotal: 11
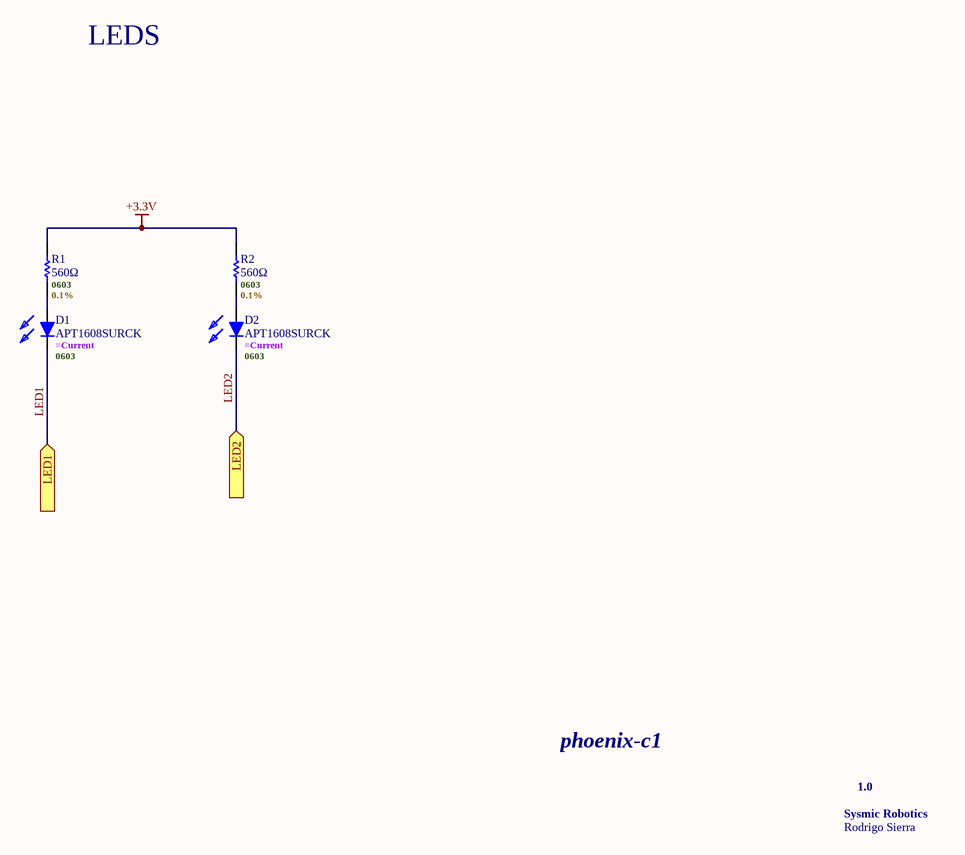
[diagram p9: leds.SchDoc]

### Parts
D1  APT1608SURCK  .Case/Package: 0603  [LED0603 - KINGBRIGHT]
D2  APT1608SURCK  .Case/Package: 0603  [LED0603 - KINGBRIGHT]
R1  560Ω  .Case/Package: 0603  .Tolerance: 0.1%  [R0603 - YAGEO]
R2  560Ω  .Case/Package: 0603  .Tolerance: 0.1%  [R0603 - YAGEO]

### Ports
LED1 (in, see phoenix-c1-sch[2C], stm32g4[3C]), LED2 (in, see phoenix-c1-sch[2C], stm32g4[3C])

### Nets
+3.3V: R1.2 R2.2
LED1: D1.1 ; port LED1
LED2: D2.1 ; port LED2
NetD1_2: D1.2 R1.1
NetD2_2: D2.2 R2.1

### Notes on the sheet
- LEDS
- phoenix-c1
- Sysmic Robotics
- 1.0
- Rodrigo Sierra

### Library data of the parts
D1 D2 = APT1608SURCK: APT1608SURCK Red Led, 630 Nm 1608 (0603) Clear, Rectangle Lens SMD Package; Manufacturer: Kingbright; Dominant Wavelength: 630nm; Forward Current: 30mA; Forward Voltage: 1.95V; Lens Style: Clear, Flat; Luminous Intensity: 150mcd; Max Junction Temperature (Tj): 115°C; Number of Circuits: 1; Peak Wavelength: 650nm; Power Dissipation: 75mW; Reverse Voltage: 5V; Shape: Rectangular; Test Current: 20mA; Viewing Angle: 120°; Supplier: Mouser; Supplier Part Number: 604-APT1608SURCK; Manufacturer Part Number: APT1608SURCK; RoHS: Compliant; Category: LEDs; Stock: 38283; Pricing: 1=0,2, 10=0,136, 50=0,136, 100=0,091, 1000=0,067, 10000=0,049 (USD); Case/Package: 0603; Case Code (Imperial): 0603; Case Code (Metric): 1608; Color: Red; Contact Plating: Gold; Height: 750µm; Illumination Color: Red; Lead Free: Lead Free; Length: 1.6mm; Lens Color: Clear; Lifecycle Status: Production; Max Operating Temperature: 85°C; Min Operating Temperature: -40°C; Mounting Technology: Surface Mount; Number of LEDs: 1; Pins: 2; Number of Terminals: 2; Packaging: Tape & Reel (TR); REACH SVHC: Yes; Schedule B: 8541402000, 8541402000|8541402000, 8541402000|8541402000|8541402000, 8541402000|8541402000|8541402000|8541402000; Terminal Pitch: 1.65mm; Wavelength: 630nm; Width: 800µm; ComponentLink1URL: https://datasheet.octopart.com:443/APT1608SURCK-Kingbright-datasheet-180517304.pdf?src-supplier=IHS; ComponentLink1Description: https://datasheet.octopart.com:443/APT1608SURCK-Kingbright-datasheet-180517304.pdf?src-supplier=IHS; ComponentLink2URL: https://datasheet.octopart.com:443/APT1608SURCK-Kingbright-datasheet-158492.pdf?src-supplier=IHS; ComponentLink2Description: https://datasheet.octopart.com:443/APT1608SURCK-Kingbright-datasheet-158492.pdf?src-supplier=IHS; ComponentLink3URL: https://datasheet.octopart.com:443/APT1608SURCK-Kingbright-datasheet-134530437.pdf?src-supplier=Upverter; ComponentLink3Description: https://datasheet.octopart.com:443/APT1608SURCK-Kingbright-datasheet-134530437.pdf?src-supplier=Upverter; ComponentLink4URL: https://datasheet.octopart.com:443/APT1608SURCK-Kingbright-datasheet-8331631.pdf?src-supplier=Sager+Electronics; ComponentLink4Description: https://datasheet.octopart.com:443/APT1608SURCK-Kingbright-datasheet-8331631.pdf?src-supplier=Sager+Electronics; ComponentLink5URL: https://datasheet.octopart.com:443/APT1608SURCK-Kingbright-datasheet-9964258.pdf?src-supplier=RS+(Formerly+Allied+Electronics); ComponentLink5Description: https://datasheet.octopart.com:443/APT1608SURCK-Kingbright-datasheet-9964258.pdf?src-supplier=RS+(Formerly+Allied+Electronics); Supplier 1: Mouser; Supplier Part Number 1: 604-APT1608SURCK; .Current: =Current
R1 R2 = RT0603BRD07560RL: Res Thin Film 0603 560 Ohm 0.1% 0.1W(1/10W) ±25ppm/C Pad SMD T/R; Manufacturer: Yageo Group; Max Power Dissipation: 100mW; Temperature Coefficient: 25ppm/°C; Voltage Rating: 75V; Voltage Rating (DC): 50V; Supplier: Mouser; Supplier Part Number: 603-RT0603BRD07560RL; Manufacturer Part Number: RT0603BRD07560RL; RoHS: Compliant; Category: Chip SMD Resistors; Stock: 19960; Pricing: 1=0,1, 10=0,053, 50=0,053, 100=0,046, 1000=0,042, 10000=0,039 (USD); Case/Package: 0603; Case Code (Imperial): 0603; China RoHS: Non-Compliant; Composition: Thin Film; Contact Plating: Tin; Depth: 800µm; Features: Moisture Resistant; Height: 450µm; Lead Free: Lead Free; Length: 1.6mm; Lifecycle Status: Production; Max Operating Temperature: 155°C; Military Standard: Not; Min Operating Temperature: -55°C; Mounting Technology: Surface Mount; Number of Terminals: 2; Number of Terminations: 2; Power Dissipation: 100mW; Power Rating: 100mW; Radiation Hardening: No; REACH SVHC: Yes; Value: 560Ω; Schedule B: 8533210045, 8533210045|8533210045, 8533210045|8533210045|8533210045, 8533210045|8533210045|8533210045|8533210045; Termination: SMD/SMT; Tolerance: 0.1%; Weight: 2.012816mg; Width: 800µm; Working Voltage: 75V; ComponentLink1URL: https://datasheet.octopart.com:443/RT0603BRD07560RL-Yageo-datasheet-176402239.pdf?src-supplier=Newark; ComponentLink1Description: https://datasheet.octopart.com:443/RT0603BRD07560RL-Yageo-datasheet-176402239.pdf?src-supplier=Newark; ComponentLink2URL: https://datasheet.octopart.com:443/RT0603BRD07560RL-Yageo-datasheet-96443642.pdf?src-supplier=Upverter; ComponentLink2Description: https://datasheet.octopart.com:443/RT0603BRD07560RL-Yageo-datasheet-96443642.pdf?src-supplier=Upverter; ComponentLink3URL: https://datasheet.octopart.com:443/RT0603BRD07560RL-Yageo-datasheet-169971040.pdf?src-supplier=Future+Electronics; ComponentLink3Description: https://datasheet.octopart.com:443/RT0603BRD07560RL-Yageo-datasheet-169971040.pdf?src-supplier=Future+Electronics; ComponentLink4URL: https://datasheet.octopart.com:443/RT0603BRD07560RL-Yageo-datasheet-166250672.pdf?src-supplier=Future+Electronics; ComponentLink4Description: https://datasheet.octopart.com:443/RT0603BRD07560RL-Yageo-datasheet-166250672.pdf?src-supplier=Future+Electronics; ComponentLink5URL: https://datasheet.octopart.com:443/RT0603BRD07560RL-Yageo-datasheet-137700930.pdf?src-supplier=Future+Electronics; ComponentLink5Description: https://datasheet.octopart.com:443/RT0603BRD07560RL-Yageo-datasheet-137700930.pdf?src-supplier=Future+Electronics; ComponentLink6URL: https://datasheet.octopart.com:443/RT0603BRD07560RL-Yageo-Group-datasheet-141265893.pdf?src-supplier=ODG+(Origin+Data+Global); ComponentLink6Description: https://datasheet.octopart.com:443/RT0603BRD07560RL-Yageo-Group-datasheet-141265893.pdf?src-supplier=ODG+(Origin+Data+Global); ComponentLink7URL: https://datasheet.octopart.com:443/RT0603BRD07560RL-Yageo-datasheet-10915759.pdf?src-supplier=_legacy+Avnet; ComponentLink7Description: https://datasheet.octopart.com:443/RT0603BRD07560RL-Yageo-datasheet-10915759.pdf?src-supplier=_legacy+Avnet; ComponentLink8URL: https://datasheet.octopart.com/RT0603BRD07560RL-Yageo-datasheet-86813807.pdf; ComponentLink8Description: https://datasheet.octopart.com/RT0603BRD07560RL-Yageo-datasheet-86813807.pdf; ComponentLink9URL: http://sigma.octopart.com:80/rohs_statement/Yageo-company-2.pdf?src-supplier=Compliance+Statements; ComponentLink9Description: http://sigma.octopart.com:80/rohs_statement/Yageo-company-2.pdf?src-supplier=Compliance+Statements; ComponentLink10URL: http://sigma.octopart.com:80/conflict_mineral_statement/Yageo-company-3.pdf?src-supplier=Compliance+Statements; ComponentLink10Description: http://sigma.octopart.com:80/conflict_mineral_statement/Yageo-company-3.pdf?src-supplier=Compliance+Statements; Supplier 1: Mouser; Supplier Part Number 1: 603-RT0603BRD07560RL